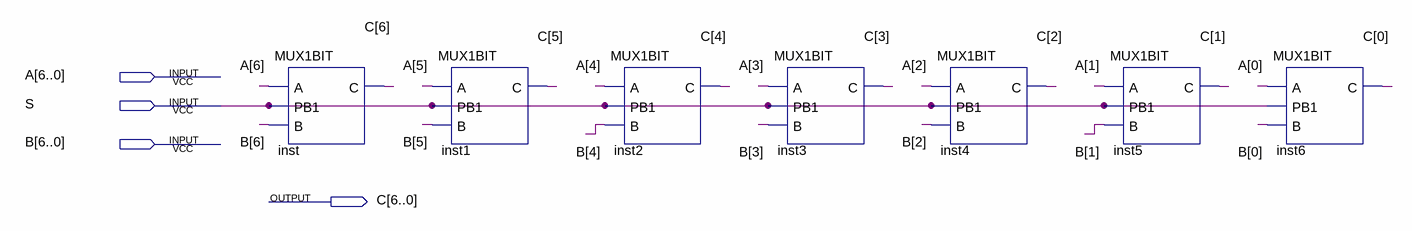
[diagram p0: schematic sheet]
// Quartus schematic MUX7BITS.bdf as structural Verilog: 7 symbols, 4 pins
module MUX7BITS (
  input  [6:0] A,
  input  S,
  input  [6:0] B,
  output [6:0] C
);

  MUX1BIT inst (.A(A[6]), .PB1(S), .B(B[6]), .C(C[6]));
  MUX1BIT inst1 (.A(A[5]), .PB1(S), .B(B[5]), .C(C[5]));
  MUX1BIT inst2 (.A(A[4]), .PB1(S), .B(B[4]), .C(C[4]));
  MUX1BIT inst3 (.A(A[3]), .PB1(S), .B(B[3]), .C(C[3]));
  MUX1BIT inst4 (.A(A[2]), .PB1(S), .B(B[2]), .C(C[2]));
  MUX1BIT inst5 (.A(A[1]), .PB1(S), .B(B[1]), .C(C[1]));
  MUX1BIT inst6 (.A(A[0]), .PB1(S), .B(B[0]), .C(C[0]));
endmodule
